# EAGLE design 2channelrelaydriver_smd (EAGLE 7.2.0)
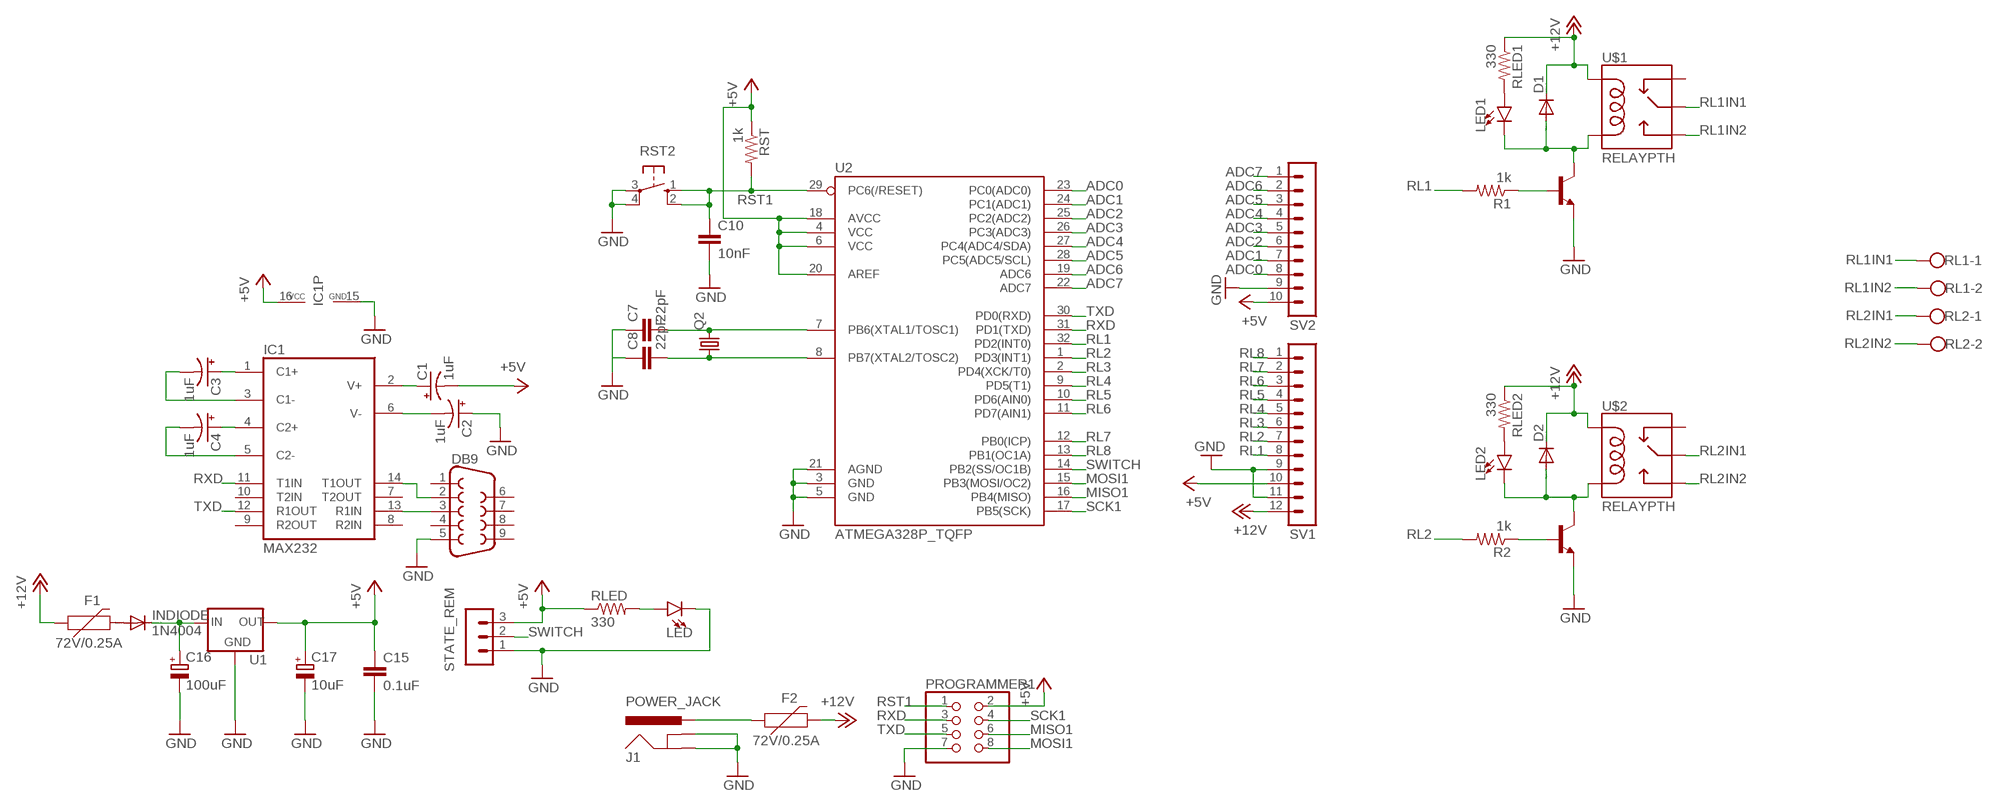
[diagram p0: schematic, sheet 1]

## Parts
C1  1uF  CPOL-USE2.5-6  [E2,5-6]
C2  1uF  CPOL-USE2.5-6  [E2,5-6]
C3  1uF  CPOL-USE2.5-6  [E2,5-6]
C4  1uF  CPOL-USE2.5-6  [E2,5-6]
C7  22pF  C-EUC1206  [C1206]
C8  22pF  C-EUC1206  [C1206]
C10  10nF  C-EUC1206  [C1206]
C15  0.1uF  C-EUC1206  [C1206]
C16  100uF  CPOL-EUE2.5-6  [E2,5-6]
C17  10uF  CPOL-EUE2.5-6  [E2,5-6]
D1  1N4004  [DO41-10]
D2  1N4004  [DO41-10]
DB9  DB9FEMALE  [DB9]
F1  72V/0.25A  PPTC_PTH  [PTH]
F2  72V/0.25A  PPTC_PTH  [PTH]
IC1  MAX232  [DIL16]
INDIODE  1N4004  [DO41-10]
J1  POWER_JACK  [POWER_JACK_PTH]
LED  LED5MM  [LED_5MM]
LED1  LED5MM  [LED_5MM]
LED2  LED5MM  [LED_5MM]
PROGRAMMER1  PINHD-2X4  [2X04]
Q2  CRYSTALHC49U70  [HC49U70]
R1  1k  R-US_M1206  [M1206]
R2  1k  R-US_M1206  [M1206]
RL1  W237-102  [W237-102]
RL2  W237-102  [W237-102]
RLED  330  R-US_M1206  [M1206]
RLED1  330  R-US_M1206  [M1206]
RLED2  330  R-US_M1206  [M1206]
RST  1k  R-US_M1206  [M1206]
RST2  10-XX  [B3F-10XX]
STATE_REM  MA03-1  [MA03-1]
SV1  MA12-1  [MA12-1]
SV2  MA10-1  [MA10-1]
T1  BC847  [SOT23]
T2  BC847  [SOT23]
U1  V_REG_78XXSIDE  [78XXL]
U2  ATMEGA328P_TQFP  [TQFP32-08]
U$1  RELAYPTH  [SRD-05VDC-SL-C]
U$2  RELAYPTH  [SRD-05VDC-SL-C]

## Nets
+12V: D1.C D2.C F1.P$1 F2.P$2 RLED1.1 RLED2.1 SV1.12 U$1.COIL1 U$2.COIL1
ADC0: SV2.8 U2.23(PC0(ADC0))
ADC1: SV2.7 U2.24(PC1(ADC1))
ADC2: SV2.6 U2.25(PC2(ADC2))
ADC3: SV2.5 U2.26(PC3(ADC3))
ADC4: SV2.4 U2.27(PC4(ADC4/SDA))
ADC5: SV2.3 U2.28(PC5(ADC5/SCL))
ADC6: SV2.2 U2.19(ADC6)
ADC7: SV2.1 U2.22(ADC7)
MISO1: PROGRAMMER1.6 U2.16(PB4(MISO))
MOSI1: PROGRAMMER1.8 U2.15(PB3(MOSI/OC2))
N$1: DB9.2 IC1.14(T1OUT)
N$2: LED.A RLED.2
N$3: C16.+ INDIODE.C U1.IN
N$4: D2.A LED2.K(C) T2.3(C) U$2.COIL0
N$5: D1.A LED1.K(C) T1.3(C) U$1.COIL0
N$6: R1.1 T1.1(B)
N$7: R2.1 T2.1(B)
N$8: LED1.A RLED1.2
N$9: LED2.A RLED2.2
N$10: F2.P$1 J1.PWR
N$18: C1.+ IC1.2(V+)
N$20: C2.- IC1.6(V-)
N$21: C7.2 Q2.2 U2.7(PB6(XTAL1/TOSC1))
N$22: C8.2 Q2.1 U2.8(PB7(XTAL2/TOSC2))
N$23: C3.+ IC1.1(C1+)
N$24: C4.+ IC1.4(C2+)
N$25: C4.- IC1.5(C2-)
N$26: C3.- IC1.3(C1-)
N$28: F1.P$2 INDIODE.A
PIN13: DB9.3 IC1.13(R1IN)
RL1: R1.2 SV1.8 U2.32(PD2(INT0))
RL1IN1: RL1.1 U$1.SWCOMMON
RL1IN2: RL1.2 U$1.SWOPEN
RL2: R2.2 SV1.7 U2.1(PD3(INT1))
RL2IN1: RL2.1 U$2.SWCOMMON
RL2IN2: RL2.2 U$2.SWOPEN
RL3: SV1.6 U2.2(PD4(XCK/T0))
RL4: SV1.5 U2.9(PD5(T1))
RL5: SV1.4 U2.10(PD6(AIN0))
RL6: SV1.3 U2.11(PD7(AIN1))
RL7: SV1.2 U2.12(PB0(ICP))
RL8: SV1.1 U2.13(PB1(OC1A))
RST1: C10.1 PROGRAMMER1.1 RST2.1(S) RST2.2(S1) RST.2 U2.29(PC6(/RESET))
RXD: IC1.11(T1IN) PROGRAMMER1.3 U2.31(PD1(TXD))
SCK1: PROGRAMMER1.4 U2.17(PB5(SCK))
SWITCH: STATE_REM.2 U2.14(PB2(SS/OC1B))
TXD: IC1.12(R1OUT) PROGRAMMER1.5 U2.30(PD0(RXD))
VDD: C1.- C15.1 C17.+ IC1.16(VCC) PROGRAMMER1.2 RLED.1 RST.1 STATE_REM.3 SV1.10 SV2.10 U1.OUT U2.4(VCC) U2.6(VCC) U2.18(AVCC) U2.20(AREF) ; supply symbol labelled +5V
VSS: C2.+ C7.1 C8.1 C10.2 C15.2 C16.- C17.- DB9.5 IC1.15(GND) J1.GND J1.GNDBREAK LED.K(C) PROGRAMMER1.7 RST2.3(P) RST2.4(P1) STATE_REM.1 SV1.9 SV1.11 SV2.9 T1.2(E) T2.2(E) U1.GND U2.3(GND) U2.5(GND) U2.21(AGND) ; supply symbol labelled GND
Unconnected: DB9.1 DB9.4 DB9.6 DB9.7 DB9.8 DB9.9 IC1.7(T2OUT) IC1.8(R2IN) IC1.9(R2OUT) IC1.10(T2IN) U$1.SWCLOSED(SWCLOSE) U$2.SWCLOSED(SWCLOSE)

## Library data of the parts
C1-C4 = rcl:CPOL-US: POLARIZED CAPACITOR, American symbol
C7 C8 C10 C15 = resistor:C-EU: CAPACITOR, European symbol
C16 C17 = rcl:CPOL-EU: POLARIZED CAPACITOR, European symbol
D1 D2 INDIODE = diode:1N4004: DIODE general purpose rectifier, 1 A
DB9 = SparkFun-Connectors:DB9: DB9 Connector Standard DB9 (D-Sub 9) serial connector. Can be used for CAN bus as well as RS485 and RS232. Footprint production proven. Here is the female version connector we sell at SparkFun: 9 Pin Female Serial Connector - PCB Mount <https://www.sparkfun.com/products/429> (PRT-00429) This connector has been used on the following SparkFun products: SparkFun RS232 Shifter - SMD <https://www.sparkfun.com/products/449> (PRT-00449) SparkFun RS232 Shifter SMD (No DB9) <https://www.sparkfun.com/products/8780> (PRT-08780); PROD_ID: CONN-08194
F1 F2 = SparkFun-Fuses:PPTC: Resettable Fuse PPTC Resettable Fuse. Really a sort of resistor with a polymeric positive temperature coefficient whose resistance increases dramatically with an increase in temperature. When heated by the power passing through the resistance rises causing the current to be limited, protecting the circuit. This is achieved by the transition of the polymer from a crystalline to an amorphous state where the conductive carbon separates breaking the conductive pathways found in the cool crystalline structure. When a PPTC cools back down it resumes conducting letting the circuit turn back on. SparkFun Products: SparkFun RedBoard - Programmed with Arduino <https://www.sparkfun.com/products/12757> Pro Micro - 5V/16MHz <https://www.sparkfun.com/products/12640> Arduino Pro 328 - 5V/16MHz <https://www.sparkfun.com/products/10915> MP3 Trigger <https://www.sparkfun.com/products/13720>; PROD_ID: RES-08490
IC1 = maxim:MAX232: RS232 TRANSCEIVER; MF: MAXIM; MPN: MAX232ACPE+; OC_FARNELL: 9723773; OC_NEWARK: 68K4544
J1 = SparkFun-Connectors:POWER_JACK: Power Jack Connector This is the standard 5.5mm barrel jack for power. The PTH is the most common, proven, reliable, footprint. The Slot footprint only works if the mill layer is transmitted to the PCB fab house so be warned. Here are the connectors we sell at SparkFun: DC Barrel Power Jack/Connector <https://www.sparkfun.com/products/119> (PRT-00119) DC Barrel Power Jack/Connector (SMD) <https://www.sparkfun.com/products/12748> (PRT-12748) DC Barrel Jack Adapter - Breadboard Compatible <https://www.sparkfun.com/products/10811> (PRT-10811) It is used on this SparkFun product (and many, many others): SparkFun RedBoard - Programmed with Arduino <https://www.sparkfun.com/products/12757> (DEV-12757) Also, if you need a mating power supply or connector, please check these out: Wall Adapter Power Supply - 9VDC 650mA <https://www.sparkfun.com/products/298> (TOL-00298) DC Barrel Jack Adapter - Male <https://www.sparkfun.com/products/10287> (PRT-10287); PROD_ID: CONN-08197
LED LED1 LED2 = SparkFun-LED:LED: LED (Generic) Standard schematic elements and footprints for 5mm, 3mm, 1206, and 0603 sized LEDs. Generic LEDs with no color specified.
PROGRAMMER1 = pinhead:PINHD-2X4: PIN HEADER
Q2 = crystal:CRYSTAL: CRYSTAL; OC_FARNELL: unknown; OC_NEWARK: unknown
R1 R2 RLED RLED1 RLED2 RST = resistor:R-US_: RESISTOR, American symbol
RL1 RL2 = con-wago-500:W237-102: WAGO SCREW CLAMP; MPN: 237-102; OC_FARNELL: unknown; OC_NEWARK: 70K9898
RST2 = switch-omron:10-XX: OMRON SWITCH; MPN: B3F-1000; OC_FARNELL: 176432; OC_NEWARK: 36M3542
STATE_REM = con-lstb:MA03-1: PIN HEADER; OC_FARNELL: unknown; OC_NEWARK: unknown
SV1 = con-lstb:MA12-1: PIN HEADER; OC_FARNELL: unknown; OC_NEWARK: unknown
SV2 = con-lstb:MA10-1: PIN HEADER; OC_FARNELL: unknown; OC_NEWARK: unknown
T1 T2 = transistor:BC847: NPN TRANSISTOR
U1 = SparkFun-IC-Power:V_REG_78XX: Voltage Regulator Standard 78xx regulator. IGO (Input Ground Output). Spark Fun Electronics SKU : COM-00107
U2 = SparkFun-IC-Microcontroller:ATMEGA328P_TQFP: Popular 328P in QFP Storefront component: ATmega328 - TQFP <https://www.sparkfun.com/products/13448> (COM-13448) Datasheet <http://www.sparkfun.com/datasheets/Components/SMD/ATMega328.pdf> SparkFun Products SparkFun RedBoard - Programmed with Arduino <https://www.sparkfun.com/products/12757> (DEV-12757) Arduino Pro Mini 328 - 5V/16MHz <https://www.sparkfun.com/products/11113> (DEV-11113) Arduino Pro Mini 328 - 3.3V/8MHz <https://www.sparkfun.com/products/11114> (DEV-11114) SparkFun OpenLog <https://www.sparkfun.com/products/13712> (DEV-13712) SparkFun MicroView - OLED Arduino Module <https://www.sparkfun.com/products/12923> (DEV-12923) SparkFun Digital Sandbox <https://www.sparkfun.com/products/12651> (DEV-12651) SparkFun PicoBoard <https://www.sparkfun.com/products/11888> (WIG-11888) Arduino Fio <https://www.sparkfun.com/products/10116> (DEV-10116) LilyPad Arduino 328 Main Board <https://www.sparkfun.com/products/13342> (DEV-13342) SparkFun RedStick <https://www.sparkfun.com/products/13741> (DEV-13741) LilyPad MP3 <https://www.sparkfun.com/products/11013> (DEV-11013) LilyPad Arduino SimpleSnap <https://www.sparkfun.com/products/10941> (DEV-10941) SparkFun Stepoko <https://www.sparkfun.com/products/13899> (ROB-13899) SparkFun Geiger Counter <https://www.sparkfun.com/products/11345> (SEN-11345) SparkFun EL Sequencer <https://www.sparkfun.com/products/12781> (COM-12781) Arduino Pro 328 - 5V/16MHz <https://www.sparkfun.com/products/10915> (DEV-10915) CryptoCape <https://www.sparkfun.com/products/12773> (DEV-12773) SparkFun IR Thermometer Evaluation Board - MLX90614 <https://www.sparkfun.com/products/10740> (SEN-10740) SparkFun RedBot Mainboard <https://www.sparkfun.com/products/12097> (ROB-12097) Arduino Pro 328 - 3.3V/8MHz <https://www.sparkfun.com/products/10914> (DEV-10914) SparkFun Block for Intel® Edison - Arduino <https://www.sparkfun.com/products/13036> (DEV-13036) SparkFun Simon Says - Surface Mount Soldering Kit <https://www.sparkfun.com/products/10935> (KIT-10935) SparkFun 7-Segment Serial Display - Red <https://www.sparkfun.com/products/11441> (COM-11441) SparkFun 7-Segment Serial Display - White <https://www.sparkfun.com/products/11629> (COM-11629) SparkFun 7-Segment Serial Display - Yellow <https://www.sparkfun.com/products/11443> (COM-11443) SparkFun 7-Segment Serial Display - Kelly Green <https://www.sparkfun.com/products/11440> (COM-11440) SparkFun 7-Segment Serial Display - Blue <https://www.sparkfun.com/products/11442> (COM-11442) SparkFun OpenSegment Serial Display - 20mm (Blue) <https://www.sparkfun.com/products/11647> (COM-11647) SparkFun OpenSegment Serial Display - 20mm (Green) <https://www.sparkfun.com/products/11646> (COM-11646) SparkFun OpenSegment Serial Display - 20mm (White) <https://www.sparkfun.com/products/11648> (COM-11648) SparkFun OpenSegment Serial Display - 20mm (Red) <https://www.sparkfun.com/products/11644> (COM-11644) SparkFun OpenSegment Serial Display - 20mm (Yellow) <https://www.sparkfun.com/products/11645> (COM-11645) SparkFun OpenSegment Shield <https://www.sparkfun.com/products/13190> (DEV-13190); PROD_ID: IC-09069
U$1 U$2 = SRD-05VDC-SL-C:RELAY: SPDT relay (COM-00101)

## Board
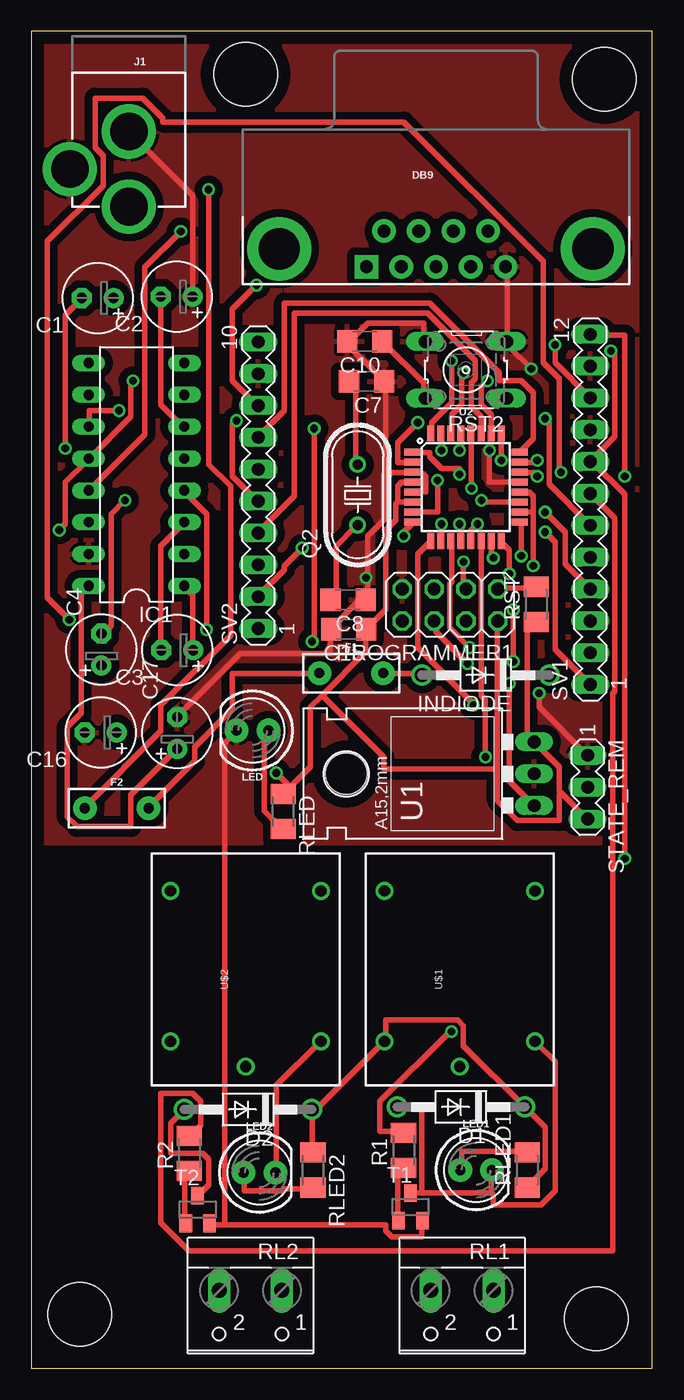
[diagram p1: board, top side]
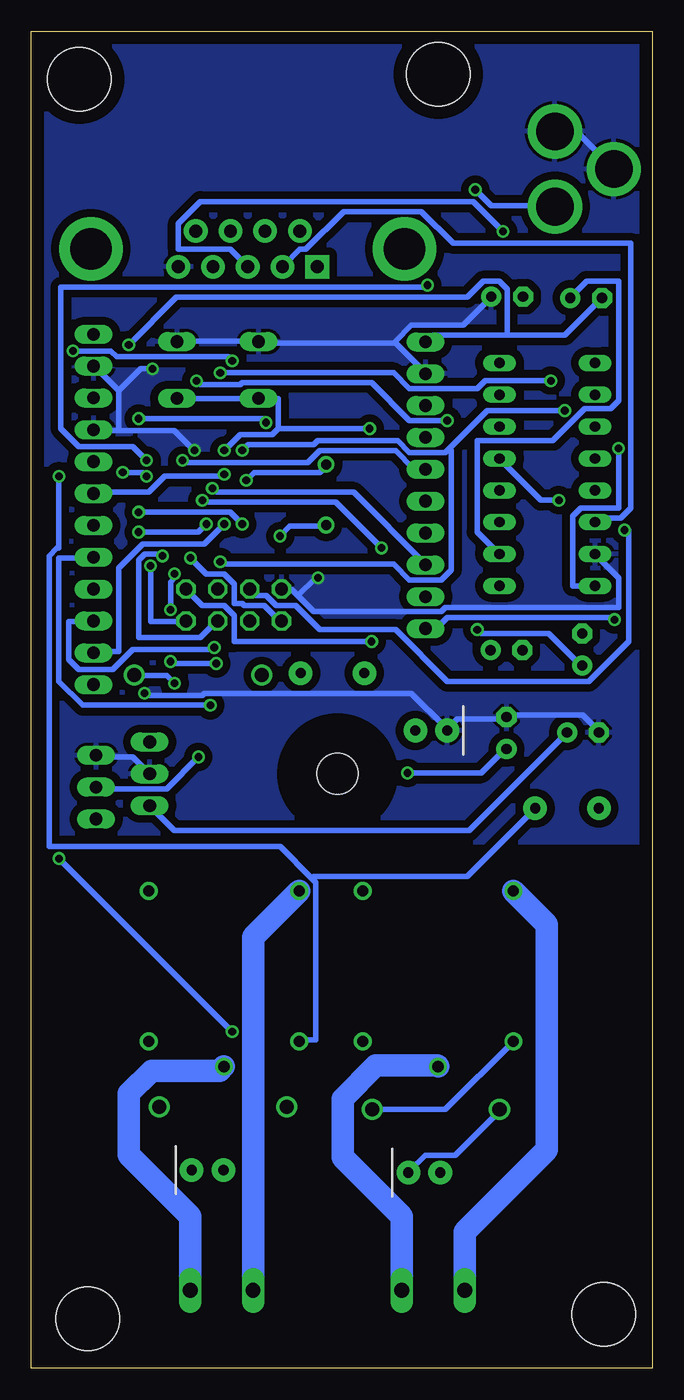
[diagram p2: board, bottom side, seen from below]

Size 49.51 x 106.6 mm. Coordinates in mm from the lower left corner, seen from the top.
Outline: 0,0 49.51,0 49.51,106.6 0,106.6 0,0
Copper layers (1*16): Top 0.035mm / dielectric 1.5mm / Bottom 0.035mm
Design rules "default *": minimum track width 18mil, minimum drill 24mil, track to track 8mil, track to pad 8mil, pad to pad 8mil, via to via 8mil, smd to smd 8mil, copper to edge 40mil, drill to drill 8mil, minimum pad ring 10mil, minimum via ring 8mil, stop-mask expansion 4mil, vias tented up to drill 0mil, thermal gap 10mil
Holes 5.08 mm at 45.67,102.78 45.01,3.92 3.87,4.28 17.07,103.19

### Footprints (pad centres in the part's own frame; a part is rotated, then mirrored left to right if it is on the bottom)
E2,5-6 = drill 0.813 pad 1.6: + -1.27,0 | drill 0.813 pad 1.6 octagon: - 1.27,0
C1206 = smd 1.6 x 1.8: 1 -1.4,0; 2 1.4,0
DO41-10 = drill 1.118: A 5.08,0; C -5.08,0
DB9 = drill 1.016 pad 1.88 square: 1 -5.54,-1.42 | drill 1.016 pad 1.88: 2 -2.77,-1.42; 3 0,-1.42; 4 2.77,-1.42; 5 5.54,-1.42; 6 -4.15,1.42; 7 -1.38,1.42; 8 1.38,1.42; 9 4.15,1.42 | drill 3.302 pad 5.08: G1 -12.5,0; G2 12.5,0
PTH = drill 0.8 pad 1.88: P$1 -2.54,0; P$2 2.54,0
DIL16 = drill 0.813 long: 1 -8.89,-3.81; 2 -6.35,-3.81; 3 -3.81,-3.81; 4 -1.27,-3.81; 5 1.27,-3.81; 6 3.81,-3.81; 7 6.35,-3.81; 8 8.89,-3.81; 9 8.89,3.81; 10 6.35,3.81; 11 3.81,3.81; 12 1.27,3.81; 13 -1.27,3.81; 14 -3.81,3.81; 15 -6.35,3.81; 16 -8.89,3.81
POWER_JACK_PTH = drill 2.997 pad 4.318: GND 0,7.7; GNDBREAK 4.7,10.7; PWR 0,13.7
LED_5MM = drill 0.813 pad 1.88: A -1.27,0; K 1.27,0
2X04 = drill 1.016 octagon: 1 -3.81,-1.27; 2 -3.81,1.27; 3 -1.27,-1.27; 4 -1.27,1.27; 5 1.27,-1.27; 6 1.27,1.27; 7 3.81,-1.27; 8 3.81,1.27
HC49U70 = drill 0.813: 1 -2.413,0; 2 2.413,0
M1206 = smd 1.6 x 2: 1 -1.4,0; 2 1.4,0
W237-102 = drill 1.194 long: 1 -2.5,-1.27; 2 2.5,-1.27
B3F-10XX = drill 1.016 long: 1 -3.251,2.261; 2 3.251,2.261; 3 -3.251,-2.261; 4 3.251,-2.261
MA03-1 = drill 1.016 long: 1 -2.54,0; 2 0,0; 3 2.54,0
MA12-1 = drill 1.016 long: 1 -13.97,0; 2 -11.43,0; 3 -8.89,0; 4 -6.35,0; 5 -3.81,0; 6 -1.27,0; 7 1.27,0; 8 3.81,0; 9 6.35,0; 10 8.89,0; 11 11.43,0; 12 13.97,0
MA10-1 = drill 1.016 long: 1 -11.43,0; 2 -8.89,0; 3 -6.35,0; 4 -3.81,0; 5 -1.27,0; 6 1.27,0; 7 3.81,0; 8 6.35,0; 9 8.89,0; 10 11.43,0
SOT23 = smd 1 x 1.4: 1 -0.95,-1.1; 2 0.95,-1.1; 3 0,1.1
78XXL = drill 1.016 long: GND 0,-3.81; IN -2.54,-3.81; OUT 2.54,-3.81 | hole 3.302: 0,11.176
TQFP32-08 = smd 1.27 x 0.559: 1 -4.293,2.8; 2 -4.293,2; 3 -4.293,1.2; 4 -4.293,0.4; 5 -4.293,-0.4; 6 -4.293,-1.2; 7 -4.293,-2; 8 -4.293,-2.8; 17 4.293,-2.8; 18 4.293,-2; 19 4.293,-1.2; 20 4.293,-0.4; 21 4.293,0.4; 22 4.293,1.2; 23 4.293,2; 24 4.293,2.8 | smd 0.559 x 1.27: 9 -2.8,-4.293; 10 -2,-4.293; 11 -1.2,-4.293; 12 -0.4,-4.293; 13 0.4,-4.293; 14 1.2,-4.293; 15 2,-4.293; 16 2.8,-4.293; 25 2.8,4.293; 26 2,4.293; 27 1.2,4.293; 28 0.4,4.293; 29 -0.4,4.293; 30 -1.2,4.293; 31 -2,4.293; 32 -2.8,4.293
SRD-05VDC-SL-C = drill 0.9: COIL0 -5.39,-6.12; COIL1 -5.39,5.88; SWCLOSED 6.61,-6.12; SWCOMMON -7.39,-0.12; SWOPEN 6.61,5.88

### Placement (x,y rotation side)
C1  5.28,85.34 180 top
C2  11.58,85.45 180 top
C3  11.63,57.25 180 top
C4  5.59,57.3 90 top
C7  26.72,78.69 180 top
C8  25.25,61.26 180 top
C10  26.57,81.89 180 top
C15  25.3,58.93 180 top
C16  5.54,50.7 180 top
C17  11.63,50.65 90 top
D1  34.24,20.83 180 top
D2  17.27,20.62 180 top
DB9  32.26,89.26 0 top
F1  25.5,55.42 0 top
F2  6.81,44.65 0 top
IC1  8.38,71.27 90 top
INDIODE  36.22,55.27 180 top
J1  7.77,106.32 180 top
LED  17.63,50.85 180 top
LED1  35.46,15.8 0 top
LED2  18.19,15.6 0 top
PROGRAMMER1  33.38,60.86 180 top
Q2  26.01,69.65 90 top
R1  29.67,17.37 90 top
R2  12.6,17.12 90 top
RL1  34.34,4.93 180 top
RL2  17.48,4.93 180 top
RLED  20.07,44.4 270 top
RLED1  39.52,15.8 90 top
RLED2  22.45,15.8 270 top
RST  40.23,60.91 90 top
RST2  34.65,79.6 180 top
STATE_REM  44.35,46.33 270 top
SV1  44.55,68.48 90 top
SV2  18.08,70.41 90 top
T1  30.23,12.85 0 top
T2  13.26,12.65 0 top
U1  36.27,47.4 90 top
U2  34.65,70.26 0 top
U$1  34.04,31.45 90 top
U$2  16.97,31.45 90 top

### Tracks (layer width: path | path; a pad name or v marks a point on that pad's centre or on a via)
+12V  (via drill 0.61)
  Top 0.457: RLED1.1 39.53,14.45 40.96,15.88 40.96,19.21 39.37,20.8 D1.C 39.21,20.96 34.45,25.72 34.45,27.3 33.97,27.78 28.26,27.78 28.26,26.19 U$1.COIL1 28.1,26.04 22.54,20.48 D2.C 22.38,20.48 22.38,17.3 RLED2.1 | v47.31,71.12 47.31,82.39 44.61,82.39 SV1.12 | F1.P$1 22.86,55.4 16.03,55.4 16.03,52.55 13.02,49.53 13.02,48.42 9.37,44.77 F2.P$2
  Bottom 0.457: U$2.COIL1 11.11,26.04 16.51,20.64 22.22,20.64 D2.C | v47.31,71.12 47.31,65.41 47.47,65.41 48.1,64.77 48.1,41.59 29.69,41.59 27.15,39.05 | 27.15,39.05 26.83,38.73 26.83,26.19 28.1,26.19 U$1.COIL1 | F2.P$2 9.37,44.61 14.76,39.21 26.99,39.21 27.15,39.05
ADC0  (via drill 0.61)
  Top 0.457: v40.32,72.39 40.32,72.23 39.05,72.23 U2.23 | v17.94,86.36 16.03,84.45 16.03,78.74 17.94,76.84 SV2.8
  Bottom 0.457: v40.32,72.39 41.43,73.5 45.72,73.5 47.15,74.93 47.15,86.2 18.1,86.2 v17.94,86.36
ADC1
  Top 0.457: U2.24 39.05,73.18 40.01,74.14 40.01,77.79 39.05,78.74 37.31,78.74 37.31,79.38 31.75,84.93 20.16,84.93 20.16,76.36 18.1,74.3 SV2.7
ADC2  (via drill 0.61)
  Top 0.457: v37.46,72.39 37.46,74.45 U2.25
  Bottom 0.457: v37.46,72.39 37.31,72.23 27.46,72.23 26.51,73.18 20.48,73.18 19.05,71.75 18.1,71.75 SV2.6
ADC3  (via drill 0.61)
  Top 0.457: v36.35,78.74 35.88,78.26 35.88,76.84 36.67,76.04 36.67,74.61 U2.26 | v16.35,75.56 16.03,75.25 16.03,71.12 17.94,69.22 SV2.5
  Bottom 0.457: v36.35,78.74 36.04,78.42 32.86,78.42 32.7,78.58 22.38,78.58 19.37,75.56 v16.35,75.56
ADC4
  Top 0.457: U2.27 35.88,74.61 35.88,75.88 35.08,76.68 35.08,78.58 35.4,78.9 35.4,80.33 31.59,84.14 20.95,84.14 20.95,69.53 18.1,66.67 SV2.4
ADC5  (via drill 0.61)
  Top 0.457: v35.08,70.17 35.08,74.45 U2.28
  Bottom 0.457: v35.08,70.17 34.77,69.85 23.81,69.85 18.1,64.14 SV2.3
ADC6  (via drill 0.61)
  Top 0.457: v35.88,69.22 35.88,69.06 38.89,69.06 U2.19 | v21.59,65.41 20.16,63.98 20.16,63.66 18.1,61.59 SV2.2
  Bottom 0.457: v35.88,69.22 35.72,69.06 25.24,69.06 v21.59,65.41
ADC7  (via drill 0.61)
  Top 0.457: v40.32,71.12 40.32,71.44 39.05,71.44 U2.22 | v42.23,71.44 42.07,71.6 42.07,78.9 40.8,80.17 40.8,88.27 29.69,99.38 10.48,99.38 10.48,99.69 8.89,101.28 5.08,101.28 5.08,97.31 5.71,96.68 5.71,94.3 1.27,89.85 1.27,61.44 v3.02,59.69
  Bottom 0.457: v40.32,71.12 40.64,71.44 v42.23,71.44 | v3.02,59.69 3.17,59.85 16.35,59.85 17.14,59.05 17.94,59.05 SV2.1
MISO1  (via drill 0.61)
  Top 0.457: v38.1,63.34 38.1,65.25 37.46,65.88 U2.16 | v38.42,56.36 v38.42,60.48 | v34.77,56.2 32.23,58.74 32.23,59.53 PROGRAMMER1.6
  Bottom 0.457: v38.1,63.34 38.1,63.02 38.42,62.71 v38.42,60.48 | v38.42,56.36 38.26,56.2 v34.77,56.2
MOSI1  (via drill 0.61)
  Top 0.457: v36.83,64.61 36.67,64.77 36.67,65.88 U2.15
  Bottom 0.457: v36.83,64.61 35.56,63.34 34.13,63.34 33.34,62.55 33.34,60.96 32.7,60.96 32.54,60.8 30.96,60.8 29.84,59.69 29.69,59.69 PROGRAMMER1.8
N$1
  Bottom 0.457: IC1.14 4.45,67.47 4.13,67.79 2.54,67.79 1.75,68.58 1.75,89.69 15.88,89.69 18.41,92.23 24.61,92.23 27.62,89.22 28.1,89.22 29.37,87.95 DB9.2
N$2
  Top 0.457: RLED.2 20,43.02 18.57,44.45 18.57,50.48 18.89,50.8 LED.A
N$3  (via drill 0.61)
  Top 0.457: v38.1,54.61 38.1,46.83 40.01,44.93 U1.IN
  Bottom 0.457: v38.1,54.61 38.73,55.25 41.27,55.25 INDIODE.C | C16.+ 6.83,50.64 14.61,42.86 38.1,42.86 40.01,44.77 U1.IN
N$4
  Top 0.457: T2.3 13.34,13.81 14.13,14.61 14.13,16.67 13.65,17.15 11.11,17.15 11.11,19.53 12.07,20.48 D2.A | U$2.COIL0 23.02,26.04 19.53,22.54 19.53,15.72 LED2.K
  Bottom 0.457: D2.A 12.22,20.48 15.72,16.99 18.1,16.99 19.37,15.72 LED2.K
N$5
  Top 0.457: 36.67,13.97 31.11,13.97 | 31.11,13.97 30.32,13.97 T1.3 | 36.67,13.97 36.67,15.72 LED1.K | U$1.COIL0 40.16,26.04 41.75,24.45 41.75,14.13 40.64,13.02 36.83,13.02 36.83,13.81 36.67,13.97 | 31.11,13.97 31.11,20.8 29.21,20.8 D1.A
N$6
  Top 0.457: T1.1 29.21,11.91 29.21,15.56 29.53,15.88 R1.1
N$7
  Top 0.457: 12.22,15.4 12.54,15.72 R2.1 | 12.22,11.59 T2.1 | 12.22,11.75 T2.1 | 12.22,15.24 R2.1 | T2.1 12.22,11.91 12.22,15.08 R2.1
N$8
  Top 0.457: RLED1.2 39.37,17.3 34.29,17.3 34.29,15.88 LED1.A
N$9
  Top 0.457: RLED2.2 22.38,14.29 20.16,14.29 20,14.13 16.99,14.13 16.99,15.56 LED2.A
N$10  (via drill 0.61)
  Top 0.457: v14.13,93.98 14.13,72.07 15.88,70.33 15.88,58.42 10.32,52.86 10.32,50.8 4.29,44.77 F2.P$1
  Bottom 0.457: v14.13,93.98 12.86,92.71 7.78,92.71 J1.PWR
N$18
  Bottom 0.457: IC1.2 12.22,64.93 13.97,66.67 13.97,73.98 7.94,73.98 5.4,76.52 3.33,76.52 2.7,77.15 2.7,86.68 5.24,86.68 6.51,85.41 C1.+
N$20
  Top 0.457: IC1.6 12.07,75.09 10.32,76.84 10.32,85.41 C2.-
N$21  (via drill 0.61)
  Top 0.457: v32.38,70.8 32.38,68.26 30.48,68.26 U2.7 | C7.2 25.4,78.58 25.88,78.11 25.88,72.07 Q2.2
  Bottom 0.457: v32.38,70.8 31.75,71.44 26.51,71.44 26.04,71.91 Q2.2
N$22  (via drill 0.61)
  Top 0.457: v29.69,66.36 29.69,66.67 30.32,67.31 U2.8 | C8.2 23.97,61.28 24.29,61.59 24.29,65.56 25.88,67.15 Q2.1
  Bottom 0.457: v29.69,66.36 28.89,67.15 26.04,67.15 Q2.1
N$23
  Top 0.457: IC1.1 12.22,62.23 12.86,61.59 12.86,57.31 C3.+
N$24  (via drill 0.61)
  Top 0.457: v13.97,58.9 13.97,68.1 12.22,69.85 IC1.4
  Bottom 0.457: v13.97,58.9 13.65,58.58 8.25,58.58 5.71,56.04 C4.+
N$25  (via drill 0.61)
  Top 0.457: v7.46,69.22 6.35,68.1 6.35,59.21 5.71,58.58 C4.-
  Bottom 0.457: v7.46,69.22 8.89,69.22 12.07,72.39 IC1.5
N$26
  Top 0.457: IC1.3 12.07,67.31 10.32,65.56 10.32,57.31 C3.-
N$28
  Top 0.457: INDIODE.A 31.11,55.4 28.1,55.4 F1.P$2
PIN13  (via drill 0.61)
  Top 0.457: v11.91,90.65 9.05,87.79 9.05,74.45 4.6,70.01 IC1.13
  Bottom 0.457: v11.91,90.65 14.29,93.03 36.04,93.03 37.78,91.28 37.78,89.22 33.66,89.22 32.38,87.95 DB9.3
RL1  (via drill 0.61)
  Top 0.457: v33.5,80.33 33.5,76.99 31.91,75.41 31.91,74.61 U2.32 | v46.2,81.12 46.51,80.8 46.51,74.3 44.61,72.39 SV1.8 44.77,72.23 47.31,69.69 v47.31,40.64 | v33.5,26.83 33.34,26.83 27.78,21.27 27.78,18.89 29.53,18.89 R1.2
  Bottom 0.457: v33.5,80.33 33.81,80.64 42.7,80.64 43.18,81.12 v46.2,81.12 | v47.31,40.64 v33.5,26.83
RL1IN1
  Bottom 1.778: RL1.1 36.84,12.1 41.76,17.02 41.76,21.89 39.93,23.72 34.49,23.72 U$1.SWCOMMON
RL1IN2
  Bottom 1.778: RL1.2 31.84,34.37 U$1.SWOPEN
RL2  (via drill 0.61)
  Top 0.457: v34.13,71.28 34.13,71.75 32.7,71.75 31.75,72.71 31.75,73.03 30.48,73.03 U2.1 | SV1.7 46.51,67.79 46.51,53.98 46.35,53.82 46.35,9.37 12.54,9.37 10.32,11.59 10.32,21.91 12.86,21.91 13.49,21.27 13.49,19.37 12.7,18.57 R2.2
  Bottom 0.457: v34.13,71.28 34.29,71.12 38.89,71.12 40.16,69.85 44.45,69.85 SV1.7
RL2IN1
  Bottom 1.778: RL2.1 19.97,12.1 24.69,16.81 24.69,21.49 22.05,24.13 17.16,24.13 U$2.SWCOMMON
RL2IN2
  Bottom 1.778: RL2.2 14.98,10.88 8.43,17.42 8.43,35.4 U$2.SWOPEN
RL3  (via drill 0.61)
  Top 0.457: v30.8,75.41 29.21,73.82 29.21,72.23 30.32,72.23 U2.2 | v40.96,75.72 41.27,75.41 41.27,70.48 SV1.6
  Bottom 0.457: v30.8,75.41 31.11,75.72 v40.96,75.72
RL4  (via drill 0.61)
  Top 0.457: v35.24,52.86 35.24,53.02 30.8,57.47 30.8,64.93 31.75,65.88 U2.9
  Bottom 0.457: v35.24,52.86 45.4,52.86 47.31,54.77 47.31,64.61 44.61,64.61 SV1.5
RL5  (via drill 0.61)
  Top 0.457: v32.7,67.31 32.7,66.04 U2.10 | v40.96,68.26 42.55,66.67 42.55,64.14 SV1.4
  Bottom 0.457: v32.7,67.31 33.66,68.26 v40.96,68.26
RL6  (via drill 0.61)
  Top 0.457: v34.92,57.47 33.34,59.05 33.34,62.55 33.5,62.71 33.5,65.88 U2.11
  Bottom 0.457: v34.92,57.47 35.08,57.31 41.43,57.31 43.02,55.72 45.72,55.72 46.51,56.52 46.51,59.53 44.61,59.53 SV1.3
RL7  (via drill 0.61)
  Top 0.457: v34.13,67.31 34.29,67.15 34.29,66.04 U2.12
  Bottom 0.457: v34.13,67.31 35.72,65.72 40.64,65.72 42.55,63.82 42.55,57.15 44.45,57.15 SV1.2
RL8  (via drill 0.61)
  Top 0.457: v35.56,67.31 35.08,66.83 35.08,66.04 U2.13 | v40.96,66.67 41.75,65.88 41.75,57.31 SV1.1
  Bottom 0.457: v35.56,67.31 36.2,66.67 v40.96,66.67
RST1  (via drill 0.61)
  Top 0.457: RST.2 40.16,62.23 37.31,62.23 PROGRAMMER1.1 | v34.13,73.18 34.29,73.34 34.29,74.45 U2.29 | C10.1 28.1,81.76 31.27,78.58 31.27,77.47 RST2.2 | v22.38,57.94 22.54,58.1 v22.54,74.93
  Bottom 0.457: v34.13,73.18 32.86,74.45 30.32,74.45 29.84,74.93 | 29.84,74.93 29.84,77.31 31.27,77.31 RST2.2 31.59,77.31 37.78,77.31 RST2.1 | v22.38,57.94 33.34,57.94 33.34,60.01 34.13,60.8 35.88,60.8 37.15,62.07 PROGRAMMER1.1 | 29.84,74.93 v22.54,74.93
RXD  (via drill 0.61)
  Top 0.457: v32.7,73.18 32.7,74.45 U2.31 | v6.99,76.36 4.6,76.36 4.6,75.09 IC1.11 | v34.45,64.29 34.45,62.39 34.61,62.23 PROGRAMMER1.3
  Bottom 0.457: v32.7,73.18 32.23,73.66 26.99,73.66 26.67,73.98 20.32,73.98 19.37,73.03 16.51,73.03 16.19,73.34 | 16.19,73.34 13.18,76.36 v6.99,76.36 | v34.45,64.29 34.29,64.14 20.64,64.14 19.37,62.87 16.83,62.87 16.03,63.66 16.03,73.18 16.19,73.34
SCK1  (via drill 0.61)
  Top 0.457: v39.05,64.77 39.05,67.31 U2.17
  Bottom 0.457: v39.05,64.77 39.21,64.93 40.48,64.93 40.96,64.45 40.96,58.26 36.04,58.26 34.77,59.53 PROGRAMMER1.4
SWITCH  (via drill 0.61)
  Top 0.457: v36.2,48.74 36.2,53.34 35.88,53.66 35.88,65.88 U2.14
  Bottom 0.457: v36.2,48.74 38.73,46.2 44.29,46.2 STATE_REM.2
TXD  (via drill 0.61)
  Top 0.457: v34.45,79.38 34.29,79.22 34.29,76.84 33.5,76.04 33.5,74.61 U2.30 | v8.1,78.74 7.94,78.58 7.94,75.88 4.6,72.55 IC1.12 4.45,72.39 2.7,70.64 2.7,67.31 v2.22,66.83
  Bottom 0.457: v34.45,79.38 20.64,79.38 19.37,78.11 13.97,78.11 13.34,78.74 v8.1,78.74 | v2.22,66.83 1.91,66.83 1.91,57.94 5.08,54.77 16.35,54.77 20.48,58.9 26.51,58.9 28.42,60.8 30,60.8 30.8,61.59 31.59,61.59 32.07,62.07 PROGRAMMER1.5
VDD  (via drill 0.61)
  Top 0.457: SV1.10 41.75,80.17 v41.75,81.6 | 40.01,68.26 39.05,68.26 U2.18 | 40.01,68.26 40.01,69.53 39.69,69.85 39.05,69.85 U2.20 | v40.01,63.98 40.01,68.26 | RST.1 40.16,59.37 39.53,58.74 39.53,50.48 40.01,50.01 U1.OUT 40.16,49.85 42.07,47.94 42.07,46.04 42.23,45.88 | 42.23,45.88 44.29,43.81 STATE_REM.3 | 37.15,47.78 37.15,45.24 38.73,43.66 42.07,43.66 42.07,45.72 42.23,45.88 | 37.15,47.78 37.15,59.53 PROGRAMMER1.2 | IC1.16 4.45,62.23 3.97,61.75 3.97,52.23 2.86,51.12 2.86,43.97 3.65,43.18 7.94,43.18 7.94,45.72 11.59,49.37 C17.+ | 29.21,69.06 30.32,69.06 U2.6 | 29.21,69.06 29.21,70.33 29.53,70.64 30.32,70.64 U2.4 | 29.21,69.06 29.05,68.9 29.05,67.63 28.26,66.83 28.26,60.48 26.83,59.05 C15.1 26.67,58.74 26.67,57.15 23.18,53.66 | 23.18,53.66 22.22,52.7 22.22,47.94 20.16,45.88 RLED.1 20.48,46.51 v19.53,47.47 | 37.15,47.78 28.1,47.78 28.1,48.74 23.18,53.66 | v2.7,73.34 2.7,83.98 3.97,85.25 C1.-
  Bottom 0.457: 11.59,82.39 6.99,82.39 4.13,85.25 C1.- | 11.59,82.39 17.46,82.39 17.94,81.91 SV2.10 | v41.75,81.6 37.94,85.41 14.76,85.41 13.49,86.68 12.22,86.68 11.59,86.04 11.59,82.39 | v40.01,63.98 40.01,59.53 37.31,59.53 PROGRAMMER1.2 | v19.53,47.47 13.65,47.47 11.75,49.37 C17.+ | v2.7,73.34 2.7,68.58 5.71,68.58 6.35,67.94 6.35,62.39 4.6,62.39 IC1.16
VSS  (via drill 0.61)
  Top 0.457: 15.4,11.43 28.26,11.43 28.26,10.95 28.73,10.48 31.11,10.48 31.11,11.75 T1.2 | 15.4,11.43 14.29,11.43 T2.2 | v40.48,53.82 40.48,52.7 44.29,48.9 STATE_REM.1 | 15.4,11.43 15.4,49.85 16.35,50.8 LED.K | U2.5 30.48,69.85 31.43,69.85 31.43,71.12 31.11,71.44 30.48,71.44 U2.3 30.16,71.44 28.26,71.44 | 28.26,71.44 28.26,78.58 C7.1 28.1,78.74 25.24,81.6 25.24,81.76 C10.2 25.4,81.91 26.83,83.34 31.27,83.34 31.27,81.91 RST2.4 | 26.83,63.02 26.83,66.36 28.1,67.63 28.1,71.28 28.26,71.44 | 26.83,63.02 26.83,61.59 26.67,61.44 C8.1 26.51,61.12 26.04,61.12 23.97,59.05 C15.2 23.81,58.74 23.81,56.99 16.67,56.99 11.75,52.07 C17.- | v36.51,73.18 36.51,70.64 38.89,70.64 U2.21 | DB9.5 37.94,87.79 37.94,81.91 RST2.3 38.1,81.76 38.1,81.44 v39.85,79.69 | J1.GND 7.78,98.58 12.86,93.5 12.86,85.57 C2.+ | v26.67,63.02 26.83,63.02
  Bottom 0.457: U1.GND 40.16,47.47 41.43,48.74 44.29,48.74 STATE_REM.1 | C16.- 4.29,50.8 5.56,52.07 11.59,52.07 C17.- 11.75,51.75 15.56,51.75 16.35,50.96 LED.K 16.51,51.12 19.21,53.82 35.72,53.82 35.88,53.66 40.32,53.66 v40.48,53.82 | 28.26,61.59 28.73,62.07 29.53,62.07 PROGRAMMER1.7 | 28.26,61.59 26.99,60.33 16.83,60.33 16.51,60.64 2.7,60.64 2.7,63.02 4.45,64.77 IC1.15 | J1.GNDBREAK 3.17,95.73 6.03,98.58 7.62,98.58 J1.GND | v36.51,73.18 38.1,74.77 42.55,74.77 | 42.55,74.77 44.45,74.77 SV1.9 | 42.55,77.95 44.45,79.85 SV1.11 | 42.55,74.77 42.55,77.95 | 20.48,81.76 18.1,79.38 SV2.9 | 20.48,81.76 31.27,81.76 RST2.4 31.59,81.91 37.78,81.91 RST2.3 | C2.+ 12.86,85.41 15.08,83.19 19.21,83.19 20.48,81.91 20.48,81.76 | 42.55,77.95 40.8,79.69 v39.85,79.69 | 28.26,61.59 26.83,63.02 v26.67,63.02
  pour Top (isolate 0.61): 0,106.68 0,41.91 49.53,41.91 49.53,106.68
  pour Bottom (isolate 0.61): 0,106.68 0,41.91 49.53,41.91 49.53,106.68